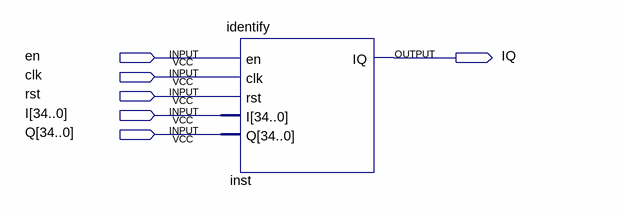
[diagram p0: schematic sheet]
// Quartus schematic Block7.bdf as structural Verilog: 1 symbols, 6 pins
module Block7 (
  input  en,
  input  clk,
  input  rst,
  input  [34:0] I,
  input  [34:0] Q,
  output IQ
);

  identify inst (.en(en), .clk(clk), .rst(rst), .I(I), .Q(Q), .IQ(IQ));
endmodule
